# EAGLE design channel-link-test-board (EAGLE 9.6.2)
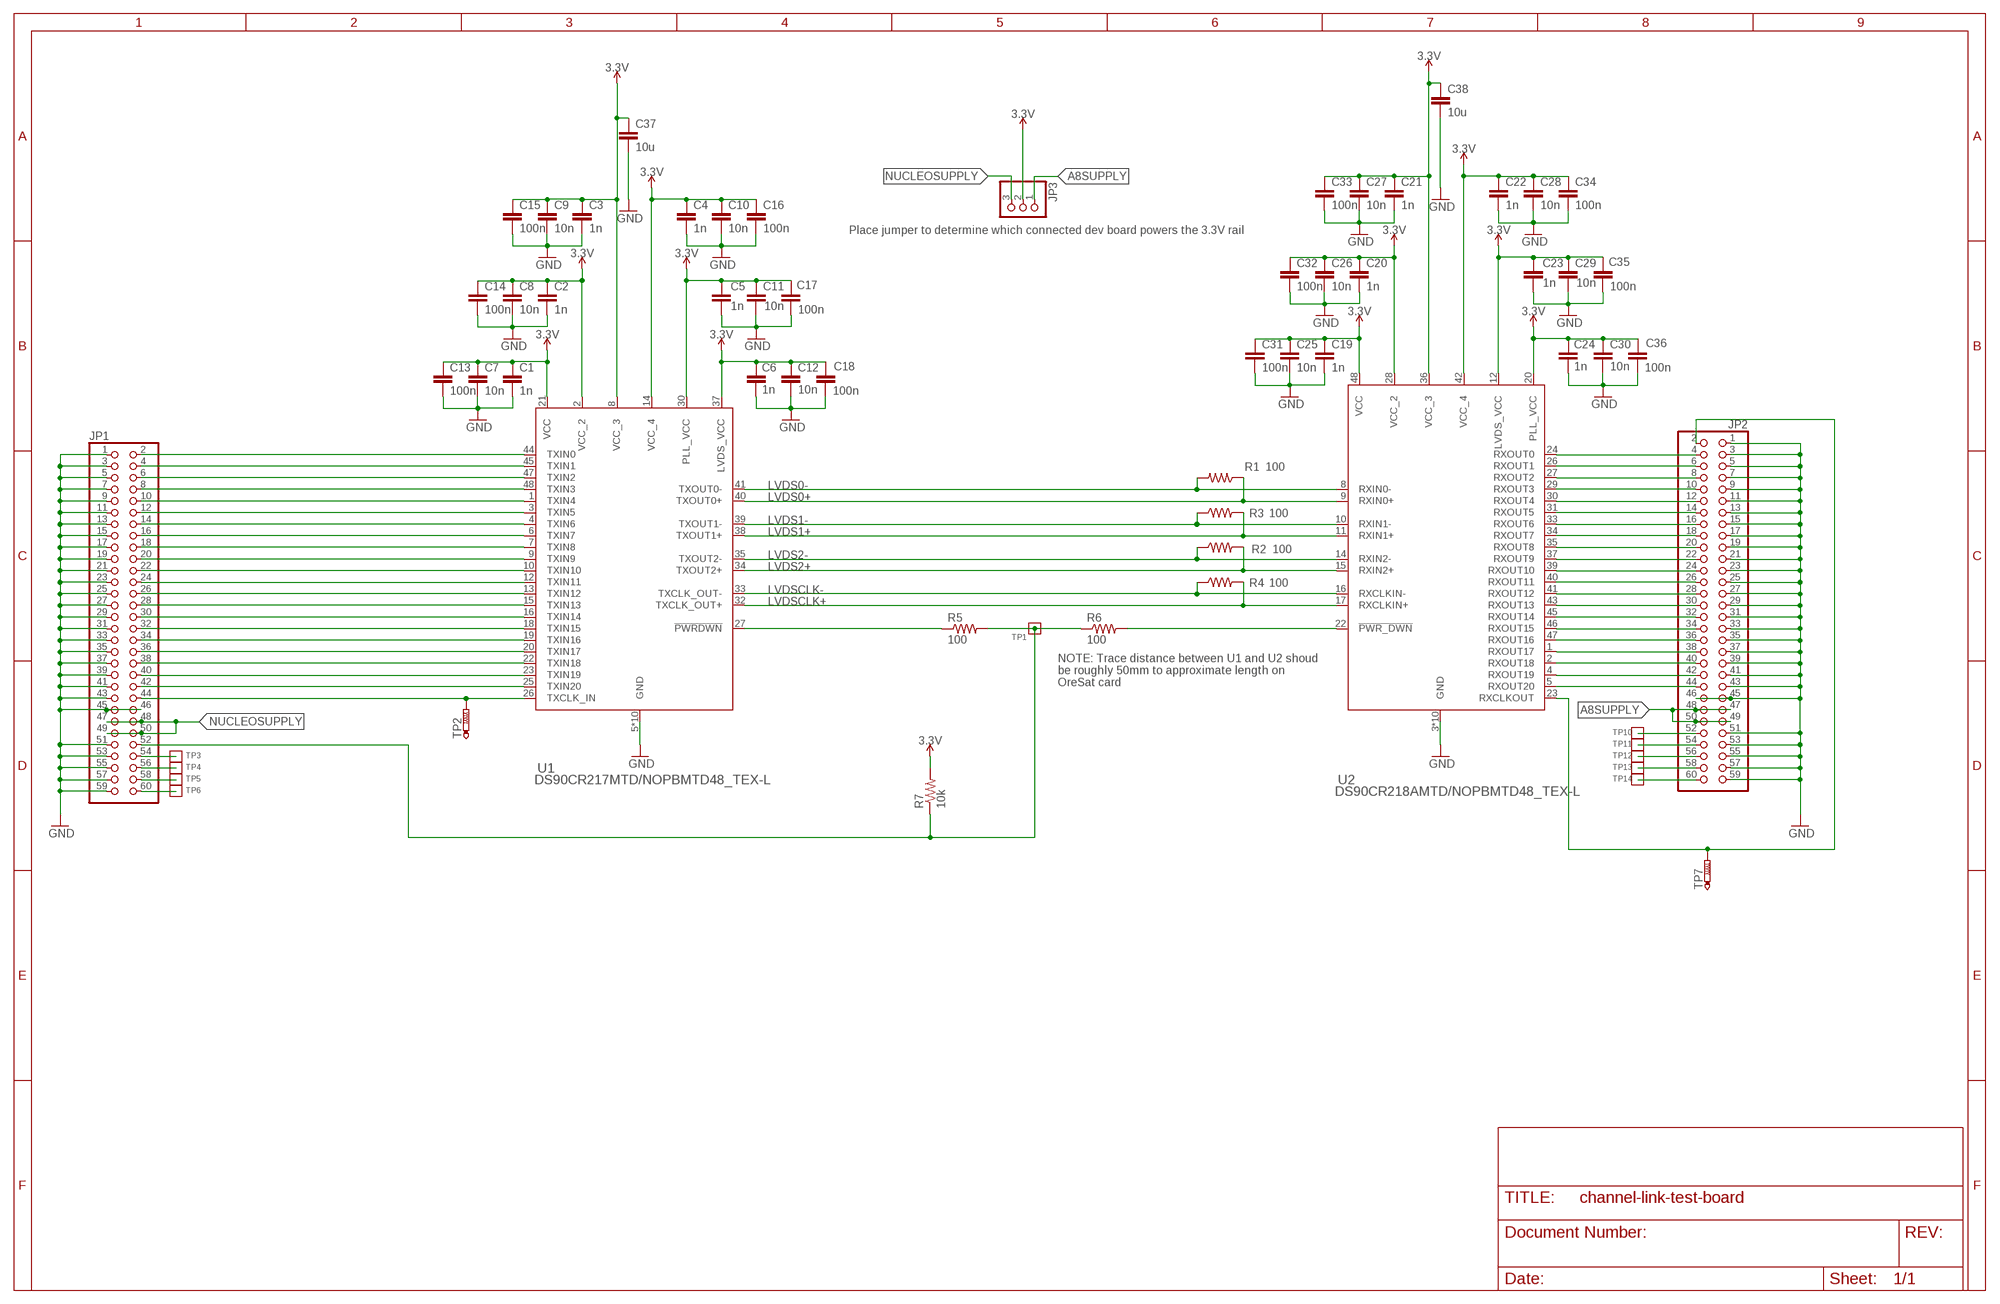
[diagram p0: schematic, sheet 1]

## Parts
C1  1n  C-EU0402-C-NOSILK  [.0402-C-NOSILK]
C2  1n  C-EU0402-C-NOSILK  [.0402-C-NOSILK]
C3  1n  C-EU0402-C-NOSILK  [.0402-C-NOSILK]
C4  1n  C-EU0402-C-NOSILK  [.0402-C-NOSILK]
C5  1n  C-EU0402-C-NOSILK  [.0402-C-NOSILK]
C6  1n  C-EU0402-C-NOSILK  [.0402-C-NOSILK]
C7  10n  C-EU0603-C-NOSILK  [.0603-C-NOSILK]
C8  10n  C-EU0603-C-NOSILK  [.0603-C-NOSILK]
C9  10n  C-EU0603-C-NOSILK  [.0603-C-NOSILK]
C10  10n  C-EU0603-C-NOSILK  [.0603-C-NOSILK]
C11  10n  C-EU0603-C-NOSILK  [.0603-C-NOSILK]
C12  10n  C-EU0402-C-NOSILK  [.0402-C-NOSILK]
C13  100n  C-EU0805-C-NOSILK  [.0805-C-NOSILK]
C14  100n  C-EU0402-C-NOSILK  [.0402-C-NOSILK]
C15  100n  C-EU0805-C-NOSILK  [.0805-C-NOSILK]
C16  100n  C-EU0805-C-NOSILK  [.0805-C-NOSILK]
C17  100n  C-EU0805-C-NOSILK  [.0805-C-NOSILK]
C18  100n  C-EU0805-C-NOSILK  [.0805-C-NOSILK]
C19  1n  C-EU0402-C-NOSILK  [.0402-C-NOSILK]
C20  1n  C-EU0402-C-NOSILK  [.0402-C-NOSILK]
C21  1n  C-EU0402-C-NOSILK  [.0402-C-NOSILK]
C22  1n  C-EU0402-C-NOSILK  [.0402-C-NOSILK]
C23  1n  C-EU0402-C-NOSILK  [.0402-C-NOSILK]
C24  1n  C-EU0402-C-NOSILK  [.0402-C-NOSILK]
C25  10n  C-EU0402-C-NOSILK  [.0402-C-NOSILK]
C26  10n  C-EU0603-C-NOSILK  [.0603-C-NOSILK]
C27  10n  C-EU0603-C-NOSILK  [.0603-C-NOSILK]
C28  10n  C-EU0603-C-NOSILK  [.0603-C-NOSILK]
C29  10n  C-EU0603-C-NOSILK  [.0603-C-NOSILK]
C30  10n  C-EU0603-C-NOSILK  [.0603-C-NOSILK]
C31  100n  C-EU0402-C-NOSILK  [.0402-C-NOSILK]
C32  100n  C-EU0805-C-NOSILK  [.0805-C-NOSILK]
C33  100n  C-EU0805-C-NOSILK  [.0805-C-NOSILK]
C34  100n  C-EU0805-C-NOSILK  [.0805-C-NOSILK]
C35  100n  C-EU0805-C-NOSILK  [.0805-C-NOSILK]
C36  100n  C-EU0805-C-NOSILK  [.0805-C-NOSILK]
C37  10u  C-EU0603-C-NOSILK  [.0603-C-NOSILK]
C38  10u  C-EU0603-C-NOSILK  [.0603-C-NOSILK]
JP1  PINHD-2X30  [2X30]
JP2  PINHD-2X30  [2X30]
JP3  PINHD-1X3  [1X03]
R1  100  R-US_0201-C-NOSILK  [.0201-C-NOSILK]
R2  100  R-US_0201-C-NOSILK  [.0201-C-NOSILK]
R3  100  R-US_0201-C-NOSILK  [.0201-C-NOSILK]
R4  100  R-US_0201-C-NOSILK  [.0201-C-NOSILK]
R5  100  R-US_0603-C-NOSILK  [.0603-C-NOSILK]
R6  100  R-US_0603-C-NOSILK  [.0603-C-NOSILK]
R7  10k  R-US_0603-C-NOSILK  [.0603-C-NOSILK]
TP1  TEST-POINT-LARGE-SQUARE  [1X01]
TP2  PTR1B2,54  [B2,54]
TP3  TEST-POINT-LARGE-SQUARE  [1X01]
TP4  TEST-POINT-LARGE-SQUARE  [1X01]
TP5  TEST-POINT-LARGE-SQUARE  [1X01]
TP6  TEST-POINT-LARGE-SQUARE  [1X01]
TP7  PTR1B2,54  [B2,54]
TP10  TEST-POINT-LARGE-SQUARE  [1X01]
TP11  TEST-POINT-LARGE-SQUARE  [1X01]
TP12  TEST-POINT-LARGE-SQUARE  [1X01]
TP13  TEST-POINT-LARGE-SQUARE  [1X01]
TP14  TEST-POINT-LARGE-SQUARE  [1X01]
U1  DS90CR217MTD/NOPBMTD48_TEX-L  [MTD48_TEX-L]
U2  DS90CR218AMTD/NOPBMTD48_TEX-L  [MTD48_TEX-L]

## Nets
3.3V: C1.1 C2.1 C3.1 C4.1 C5.1 C6.1 C7.1 C8.1 C9.1 C10.1 C11.1 C12.1 C13.1 C14.1 C15.1 C16.1 C17.1 C18.1 C19.1 C20.1 C21.1 C22.1 C23.1 C24.1 C25.1 C26.1 C27.1 C28.1 C29.1 C30.1 C31.1 C32.1 C33.1 C34.1 C35.1 C36.1 C37.1 C38.1 JP3.2 R7.2 U1.2(VCC_2) U1.8(VCC_3) U1.14(VCC_4) U1.21(VCC) U1.30(PLL_VCC) U1.37(LVDS_VCC) U2.12(LVDS_VCC) U2.20(PLL_VCC) U2.28(VCC_2) U2.36(VCC_3) U2.42(VCC_4) U2.48(VCC)
A8SUPPLY: JP2.47 JP2.48 JP2.49 JP2.50 JP3.1
GND: C1.2 C2.2 C3.2 C4.2 C5.2 C6.2 C7.2 C8.2 C9.2 C10.2 C11.2 C12.2 C13.2 C14.2 C15.2 C16.2 C17.2 C18.2 C19.2 C20.2 C21.2 C22.2 C23.2 C24.2 C25.2 C26.2 C27.2 C28.2 C29.2 C30.2 C31.2 C32.2 C33.2 C34.2 C35.2 C36.2 C37.2 C38.2 JP1.1 JP1.3 JP1.5 JP1.7 JP1.9 JP1.11 JP1.13 JP1.15 JP1.17 JP1.19 JP1.21 JP1.23 JP1.25 JP1.27 JP1.29 JP1.31 JP1.33 JP1.35 JP1.37 JP1.39 JP1.41 JP1.43 JP1.45 JP1.46 JP1.51 JP1.53 JP1.55 JP1.57 JP1.59 JP2.1 JP2.3 JP2.5 JP2.7 JP2.9 JP2.11 JP2.13 JP2.15 JP2.17 JP2.19 JP2.21 JP2.23 JP2.25 JP2.27 JP2.29 JP2.31 JP2.33 JP2.35 JP2.37 JP2.39 JP2.41 JP2.43 JP2.45 JP2.46 JP2.51 JP2.53 JP2.55 JP2.57 JP2.59 U1.5(GND) U1.11(GND) U1.17(GND) U1.24(GND) U1.28(GND) U1.29(GND) U1.31(GND) U1.36(GND) U1.42(GND) U1.46(GND) U2.3(GND) U2.7(GND) U2.13(GND) U2.18(GND) U2.19(GND) U2.21(GND) U2.25(GND) U2.32(GND) U2.38(GND) U2.44(GND)
LVDS0+: R1.1 U1.40(TXOUT0+) U2.9(RXIN0+)
LVDS0-: R1.2 U1.41(TXOUT0-) U2.8(RXIN0-)
LVDS1+: R3.2 U1.38(TXOUT1+) U2.11(RXIN1+)
LVDS1-: R3.1 U1.39(TXOUT1-) U2.10(RXIN1-)
LVDS2+: R2.2 U1.34(TXOUT2+) U2.15(RXIN2+)
LVDS2-: R2.1 U1.35(TXOUT2-) U2.14(RXIN2-)
LVDSCLK+: R4.2 U1.32(TXCLK_OUT+) U2.17(RXCLKIN+)
LVDSCLK-: R4.1 U1.33(TXCLK_OUT-) U2.16(RXCLKIN-)
N$9: JP1.2 U1.44(TXIN0)
N$10: JP1.4 U1.45(TXIN1)
N$11: JP1.6 U1.47(TXIN2)
N$12: JP1.8 U1.48(TXIN3)
N$13: JP1.10 U1.1(TXIN4)
N$14: JP1.12 U1.3(TXIN5)
N$15: JP1.14 U1.4(TXIN6)
N$16: JP1.16 U1.6(TXIN7)
N$17: JP1.18 U1.7(TXIN8)
N$18: JP1.20 U1.9(TXIN9)
N$19: JP1.22 U1.10(TXIN10)
N$20: JP1.24 U1.12(TXIN11)
N$21: JP1.26 U1.13(TXIN12)
N$22: JP1.28 U1.15(TXIN13)
N$23: JP1.30 U1.16(TXIN14)
N$24: JP1.32 U1.18(TXIN15)
N$25: JP1.34 U1.19(TXIN16)
N$26: JP1.36 U1.20(TXIN17)
N$27: JP1.38 U1.22(TXIN18)
N$28: JP1.40 U1.23(TXIN19)
N$29: JP1.42 U1.25(TXIN20)
N$30: JP1.44 TP2.TP U1.26(TXCLK_IN)
N$31: JP2.4 U2.24(RXOUT0)
N$32: JP2.6 U2.26(RXOUT1)
N$33: R5.1 U1.27(!PWRDWN)
N$34: R6.2 U2.22(!PWR_DWN)
N$35: JP2.8 U2.27(RXOUT2)
N$36: JP2.10 U2.29(RXOUT3)
N$37: JP2.12 U2.30(RXOUT4)
N$38: JP2.14 U2.31(RXOUT5)
N$39: JP2.16 U2.33(RXOUT6)
N$40: JP2.18 U2.34(RXOUT7)
N$41: JP2.20 U2.35(RXOUT8)
N$42: JP2.22 U2.37(RXOUT9)
N$43: JP2.24 U2.39(RXOUT10)
N$44: JP2.26 U2.40(RXOUT11)
N$45: JP2.28 U2.41(RXOUT12)
N$48: JP2.52 TP10.1
N$49: JP2.54 TP11.1
N$50: JP2.56 TP12.1
N$51: JP2.58 TP13.1
N$52: JP2.60 TP14.1
N$53: JP2.30 U2.43(RXOUT13)
N$54: JP2.32 U2.45(RXOUT14)
N$55: JP2.34 U2.46(RXOUT15)
N$56: JP2.36 U2.47(RXOUT16)
N$57: JP1.52 R5.2 R6.1 R7.1 TP1.1
N$58: JP1.54 TP3.1
N$59: JP1.56 TP4.1
N$60: JP1.58 TP5.1
N$61: JP1.60 TP6.1
N$62: JP2.38 U2.1(RXOUT17)
N$63: JP2.40 U2.2(RXOUT18)
N$64: JP2.42 U2.4(RXOUT19)
N$65: JP2.44 U2.5(RXOUT20)
N$66: JP2.2 TP7.TP U2.23(RXCLKOUT)
NUCLEOSUPPLY: JP1.47 JP1.48 JP1.49 JP1.50 JP3.3

## Notes on the sheet
- Place jumper to determine which connected dev board powers the 3.3V rail
- NOTE: Trace distance between U1 and U2 shoud 
  be roughly 50mm to approximate length on 
  OreSat card

## Library data of the parts
C1-C6 C19-C24 = oresat-rcl:C-EU: CAPACITOR, European symbol; DIS: Digi-Key; DPN: 490-6350-1-ND; MFR: Murata; MPN: GRM155R71H102KA01J
C7-C12 C25-C30 = oresat-rcl:C-EU: CAPACITOR, European symbol; DIS: Digi-Key; DPN: 399-7842-1-ND; MFR: Kemet; MPN: C0603C103M5RACTU
C13-C18 C31-C36 = oresat-rcl:C-EU: CAPACITOR, European symbol; DIS: Digi-Key; DPN: 399-1177-1-ND; MFR: Kemet; MPN: C0805C104Z5VACTU
C37 C38 = oresat-rcl:C-EU: CAPACITOR, European symbol; DIS: Digi-Key; DPN: 490-14372-1-ND; MFR: Murata; MPN: GRM188R61A106KE69J
JP1 JP2 = pinhead:PINHD-2X30: PIN HEADER; DIS: Digi-Key; DPN: 609-3528-ND; MFR: Amphenol; MPN: 71918-160LF
JP3 = pinhead:PINHD-1X3: PIN HEADER; DIS: Digi-Key; DPN: 732-5316-ND; MFR: Wurth; MPN: 61300311121
R1-R4 = oresat-rcl:R-US_: RESISTOR, American symbol; DIS: Dgi-Key; DPN: 311-100MCT-ND; MFR: Yageo; MPN: RC0201FR-07100RL
R5 R6 = oresat-rcl:R-US_: RESISTOR, American symbol; DIS: Digi-Key; DPN: 311-100HRCT-ND; MFR: Yageo; MPN: RC0603FR-07100RL
R7 = oresat-rcl:R-US_: RESISTOR, American symbol; DIS: Digi-Key; DPN: 311-10.0KHRCT-ND; MFR: Yageo; MPN: RC0603FR-0710KL
TP1 TP3-TP6 TP10-TP14 = oresat-misc:TEST-POINT-LARGE-SQUARE
TP2 TP7 = testpad:PTR1: TEST PIN
U1 = U-TI-DS90CR217-LVDSTransmitter:DS90CR217MTD/NOPB; DIS: Digi-Key; DPN: DS90CR218AMTD/NOPB-ND; MFR: Texas Instruments; MPN: DS90CR218AMTD/NOPB
U2 = U-TI-DS90CR218-LVDSReceiver:DS90CR218AMTD/NOPB; DIS: Digi-Key; DPN: DS90CR218AMTD/NOPB-ND; MFR: Texas Instruments; MPN: DS90CR218AMTD/NOPB

## Board
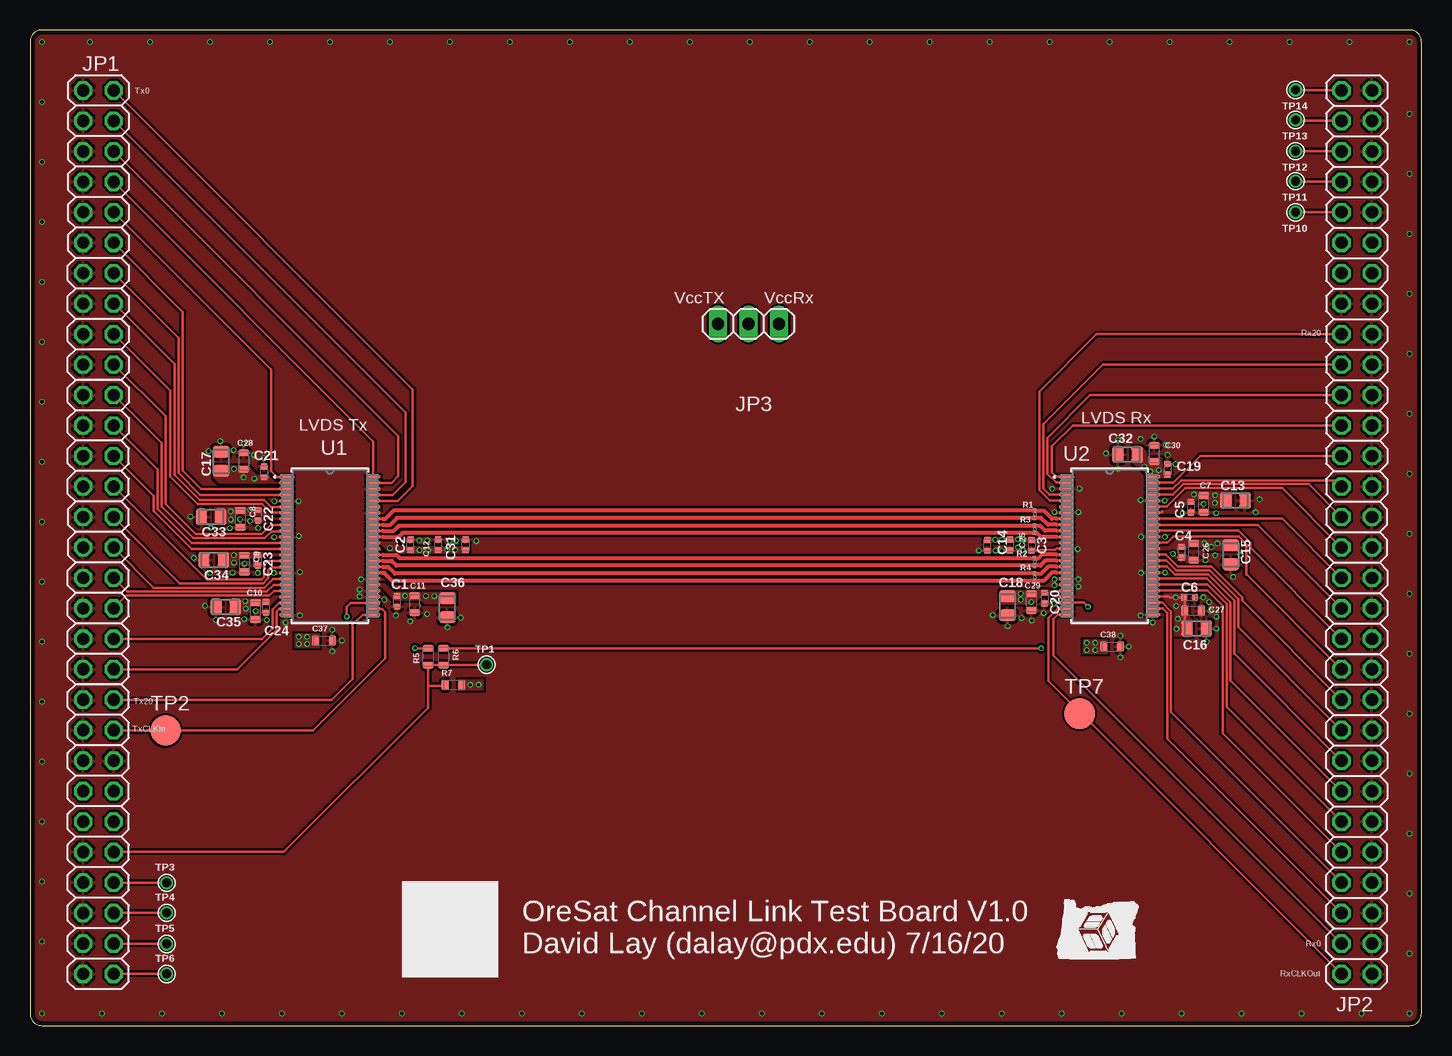
[diagram p1: board, top side]
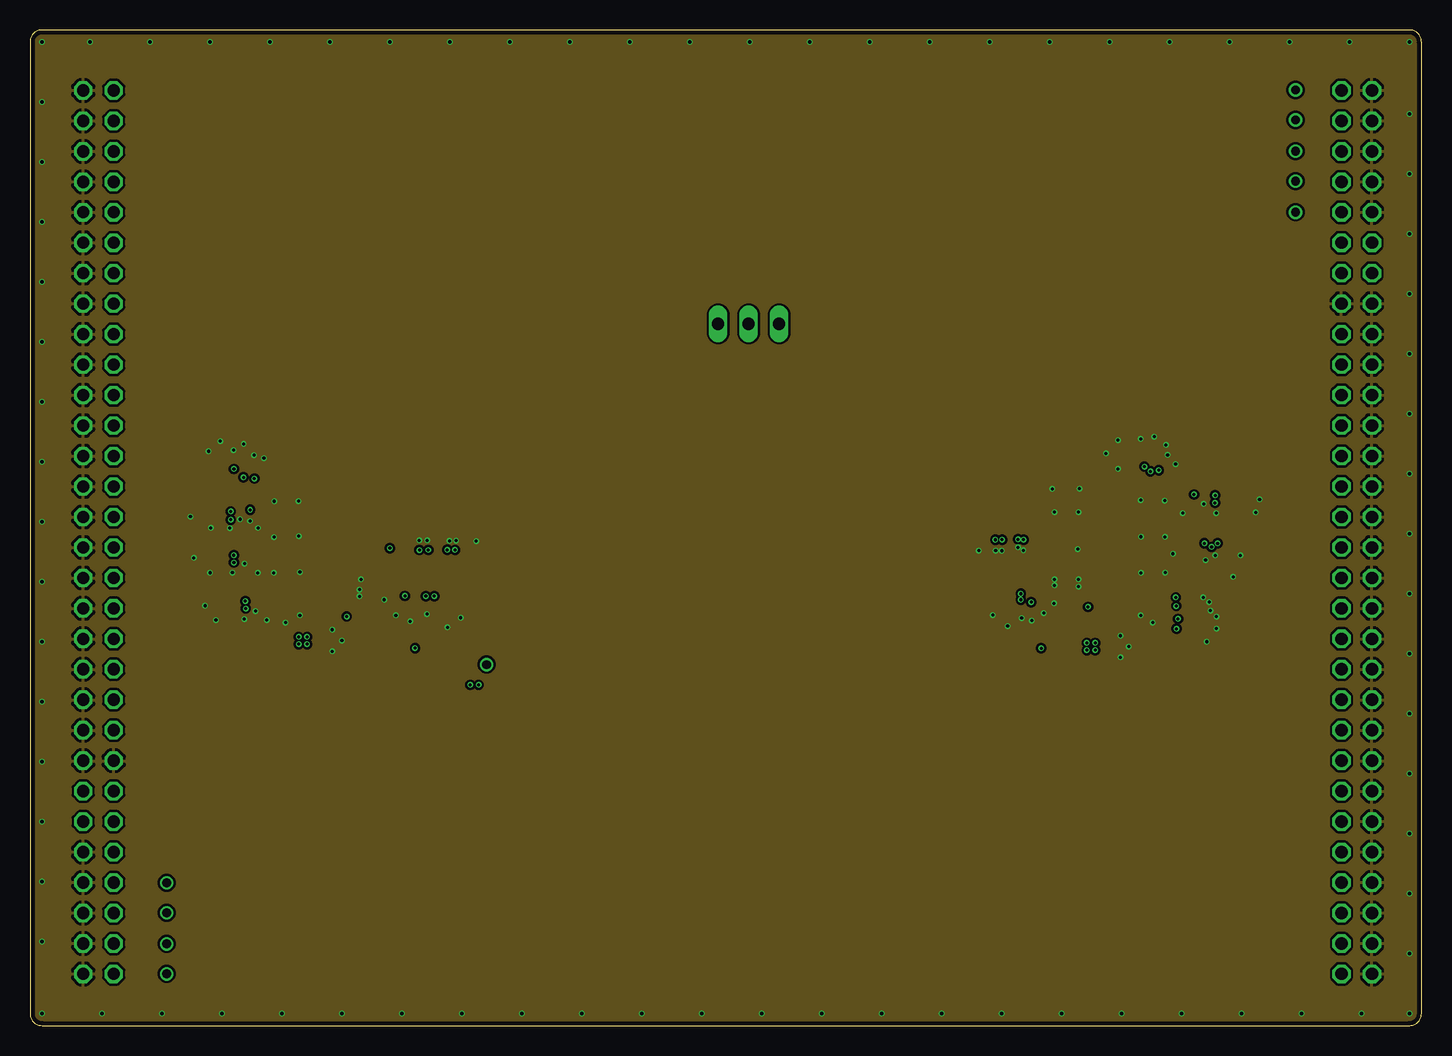
[diagram p2: board, inner layer Route2]
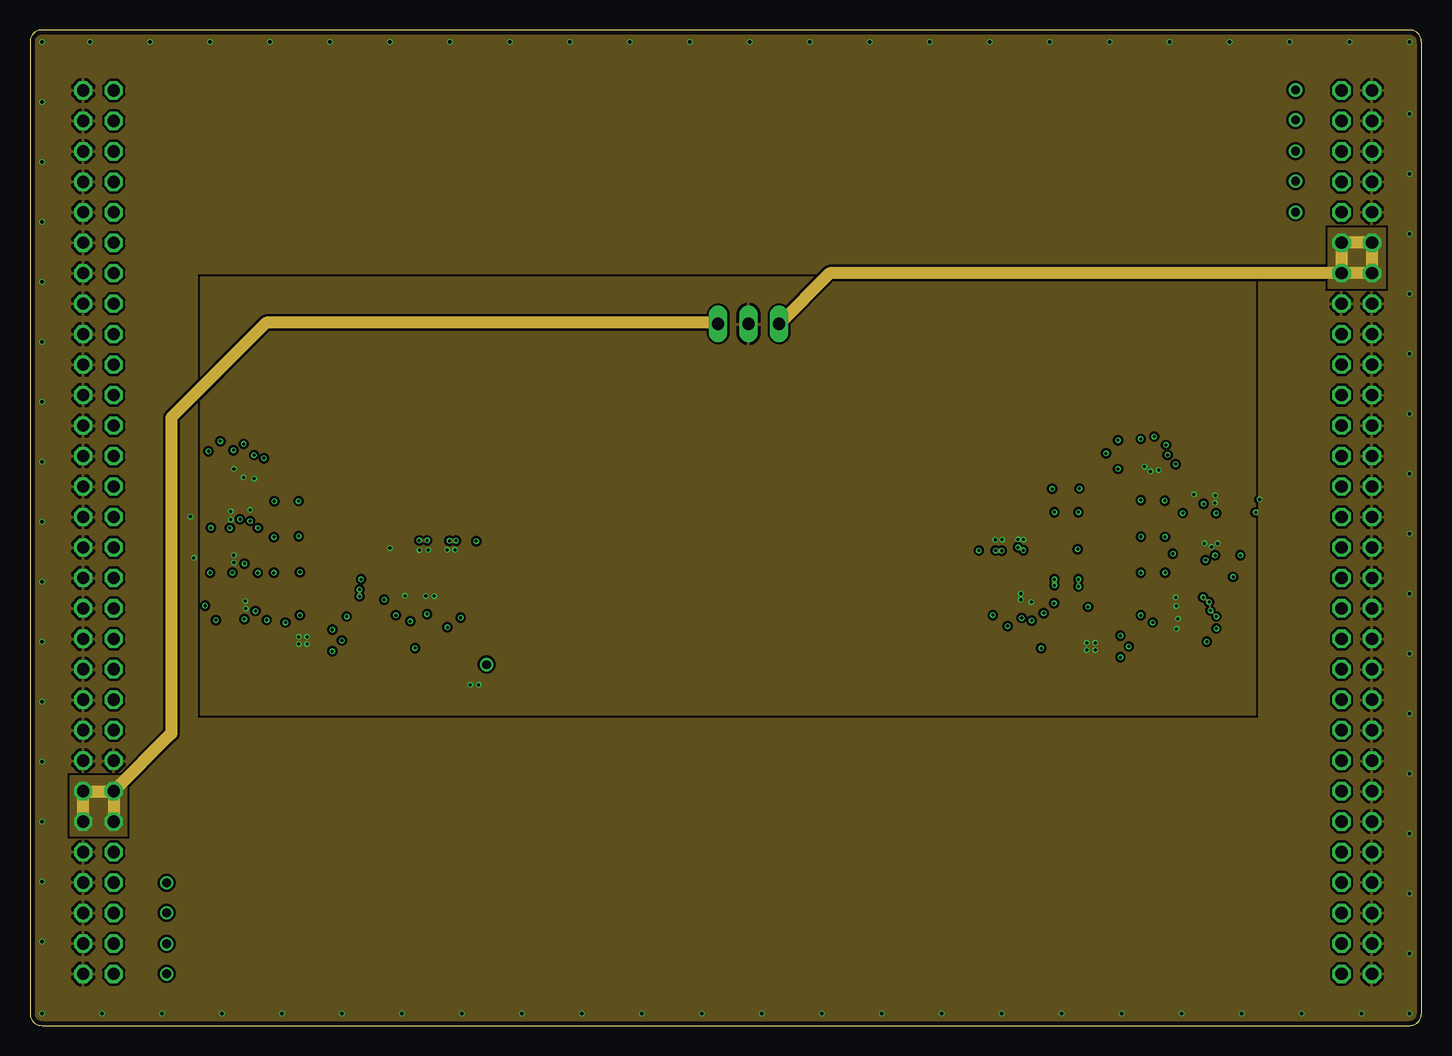
[diagram p3: board, inner layer Route15]
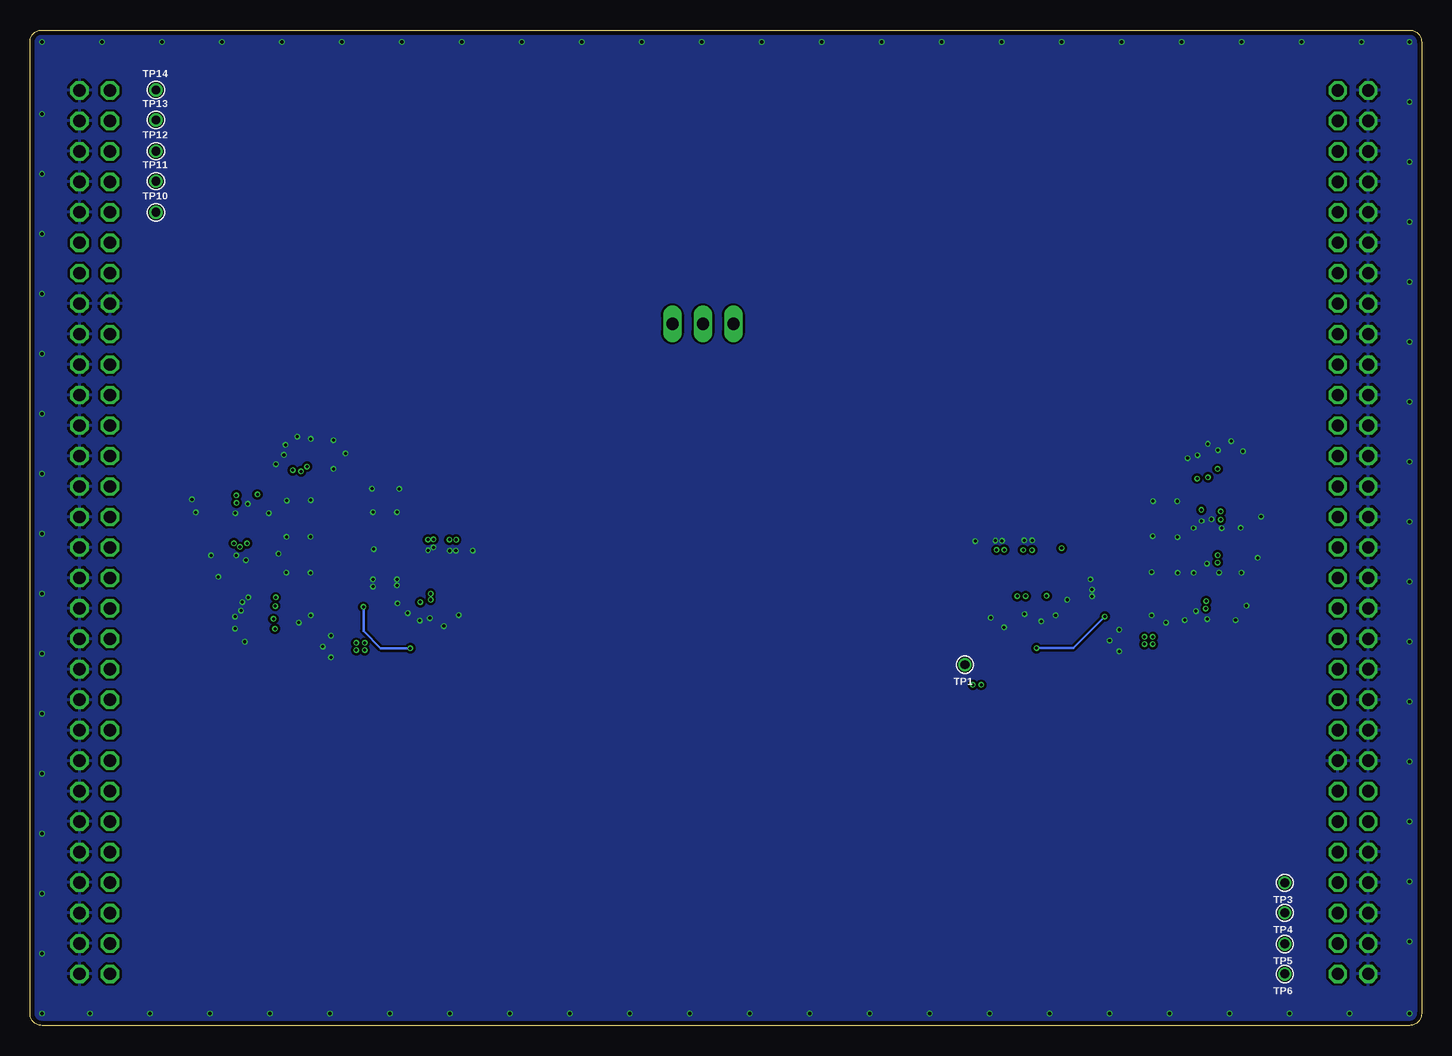
[diagram p4: board, bottom side, seen from below]

Size 116 x 83 mm. Coordinates in mm from the lower left corner, seen from the top.
Outline: 0,82 0,1 arc90 1,0 115,0 arc90 116,1 116,82 arc90 115,83 1,83 arc90 0,82
Copper layers (1*2*15*16): Top 0.035559375mm / dielectric 0.17018125mm / Route2 0.01778125mm / dielectric 47mil / Route15 0.01778125mm / dielectric 0.17018125mm / Bottom 0.035559375mm
Design rules "oshpark-4layer-tented": minimum track width 5mil, minimum drill 10mil, track to track 5mil, track to pad 5mil, pad to pad 5mil, via to via 5mil, smd to smd 5mil, copper to edge 15mil, drill to drill 6mil, minimum pad ring 4mil, minimum via ring 4mil, stop-mask expansion 2.5mil, vias tented up to drill 20mil, thermal gap 10mil

### Footprints (pad centres in the part's own frame; a part is rotated, then mirrored left to right if it is on the bottom)
.0402-C-NOSILK = smd 0.5 x 0.6: 1 -0.45,0; 2 0.45,0
.0603-C-NOSILK = smd 0.6 x 0.9: 1 -0.7,0; 2 0.7,0
.0805-C-NOSILK = smd 0.95 x 1.35: 1 -0.8,0; 2 0.8,0
2X30 = drill 1.016 octagon: 1 -38.1,-1.27; 2 -38.1,1.27; 3 -35.56,-1.27; 4 -35.56,1.27; 5 -33.02,-1.27; 6 -33.02,1.27; 7 -30.48,-1.27; 8 -30.48,1.27; 9 -27.94,-1.27; 10 -27.94,1.27; 11 -25.4,-1.27; 12 -25.4,1.27; 13 -22.86,-1.27; 14 -22.86,1.27; 15 -20.32,-1.27; 16 -20.32,1.27; 17 -17.78,-1.27; 18 -17.78,1.27; 19 -15.24,-1.27; 20 -15.24,1.27; 21 -12.7,-1.27; 22 -12.7,1.27; 23 -10.16,-1.27; 24 -10.16,1.27; 25 -7.62,-1.27; 26 -7.62,1.27; 27 -5.08,-1.27; 28 -5.08,1.27; 29 -2.54,-1.27; 30 -2.54,1.27; 31 0,-1.27; 32 0,1.27; 33 2.54,-1.27; 34 2.54,1.27; 35 5.08,-1.27; 36 5.08,1.27; 37 7.62,-1.27; 38 7.62,1.27; 39 10.16,-1.27; 40 10.16,1.27; 41 12.7,-1.27; 42 12.7,1.27; 43 15.24,-1.27; 44 15.24,1.27; 45 17.78,-1.27; 46 17.78,1.27; 47 20.32,-1.27; 48 20.32,1.27; 49 22.86,-1.27; 50 22.86,1.27; 51 25.4,-1.27; 52 25.4,1.27; 53 27.94,-1.27; 54 27.94,1.27; 55 30.48,-1.27; 56 30.48,1.27; 57 33.02,-1.27; 58 33.02,1.27; 59 35.56,-1.27; 60 35.56,1.27
1X03 = drill 1.016 long: 1 -2.54,0; 2 0,0; 3 2.54,0
.0201-C-NOSILK = smd 0.35 x 0.3: 1 -0.3,0; 2 0.3,0
1X01 = drill 0.737 pad 1.1: 1 0,0
B2,54 = smd 2.54 x 2.54: TP 0,0
MTD48_TEX-L = smd 1.162 x 0.199: 1 -3.62,5.75; 2 -3.62,5.25; 3 -3.62,4.75; 4 -3.62,4.25; 5 -3.62,3.75; 6 -3.62,3.25; 7 -3.62,2.75; 8 -3.62,2.25; 9 -3.62,1.75; 10 -3.62,1.25; 11 -3.62,0.75; 12 -3.62,0.25; 13 -3.62,-0.25; 14 -3.62,-0.75; 15 -3.62,-1.25; 16 -3.62,-1.75; 17 -3.62,-2.25; 18 -3.62,-2.75; 19 -3.62,-3.25; 20 -3.62,-3.75; 21 -3.62,-4.25; 22 -3.62,-4.75; 23 -3.62,-5.25; 24 -3.62,-5.75; 25 3.62,-5.75; 26 3.62,-5.25; 27 3.62,-4.75; 28 3.62,-4.25; 29 3.62,-3.75; 30 3.62,-3.25; 31 3.62,-2.75; 32 3.62,-2.25; 33 3.62,-1.75; 34 3.62,-1.25; 35 3.62,-0.75; 36 3.62,-0.25; 37 3.62,0.25; 38 3.62,0.75; 39 3.62,1.25; 40 3.62,1.75; 41 3.62,2.25; 42 3.62,2.75; 43 3.62,3.25; 44 3.62,3.75; 45 3.62,4.25; 46 3.62,4.75; 47 3.62,5.25; 48 3.62,5.75
MTD48_TEX-L' = smd 1.168 x 0.178: 1 -3.619,5.75; 2 -3.619,5.25; 3 -3.619,4.75; 4 -3.619,4.25; 5 -3.619,3.75; 6 -3.619,3.25; 7 -3.619,2.75; 8 -3.619,2.25; 9 -3.619,1.75; 10 -3.619,1.25; 11 -3.619,0.75; 12 -3.619,0.25; 13 -3.619,-0.25; 14 -3.619,-0.75; 15 -3.619,-1.25; 16 -3.619,-1.75; 17 -3.619,-2.25; 18 -3.619,-2.75; 19 -3.619,-3.25; 20 -3.619,-3.75; 21 -3.619,-4.25; 22 -3.619,-4.75; 23 -3.619,-5.25; 24 -3.619,-5.75; 25 3.619,-5.75; 26 3.619,-5.25; 27 3.619,-4.75; 28 3.619,-4.25; 29 3.619,-3.75; 30 3.619,-3.25; 31 3.619,-2.75; 32 3.619,-2.25; 33 3.619,-1.75; 34 3.619,-1.25; 35 3.619,-0.75; 36 3.619,-0.25; 37 3.619,0.25; 38 3.619,0.75; 39 3.619,1.25; 40 3.619,1.75; 41 3.619,2.25; 42 3.619,2.75; 43 3.619,3.25; 44 3.619,3.75; 45 3.619,4.25; 46 3.619,4.75; 47 3.619,5.25; 48 3.619,5.75

### Placement (x,y rotation side)
C1  30.6,35.37 270 top
C2  31.71,40.07 90 top
C3  83.49,40.03 270 top
C4  95.99,39.47 270 top
C5  96.79,43.21 270 top
C6  96.65,35.69 0 top
C7  97.85,43.49 270 top
C8  17.55,42.25 270 top
C9  17.87,38.51 270 top
C10  18.8,34.55 270 top
C11  32.07,35.13 270 top
C12  34.03,40.07 90 top
C13  100.49,43.77 0 top
C14  79.8,40.04 270 top
C15  100.09,39.24 270 top
C16  97.25,33.09 0 top
C17  15.94,47.04 90 top
C18  81.49,35 270 top
C19  94.82,46.38 90 top
C20  84.58,35.63 270 top
C21  19.52,46.16 90 top
C22  19.01,42.54 270 top
C23  18.98,38.79 270 top
C24  19.68,34.87 270 top
C25  81.71,40.06 270 top
C26  97.01,39.5 270 top
C27  96.95,34.58 0 top
C28  17.82,47.06 90 top
C29  83.48,35.3 270 top
C30  93.72,47.69 90 top
C31  36.31,40.07 90 top
C32  91.49,47.61 180 top
C33  15.1,42.41 180 top
C34  15.31,38.81 180 top
C35  16.32,34.91 180 top
C36  34.79,34.83 270 top
C37  24.5,32.1 0 top
C38  90.2,31.6 0 top
JP1  5.7,39.86 270 top
JP2  110.6,42.4 90 top
JP3  59.9,58.5 180 top
R1  83.73,42.63 90 top
R2  83.73,38.66 270 top
R3  83.73,41.38 270 top
R4  83.73,37.38 270 top
R5  33.19,30.75 270 top
R6  34.48,30.75 90 top
R7  35.3,28.4 0 top
TP1  38.06,30.09 0 top
TP2  11.3,24.6 0 top
TP3  11.4,11.9 0 top
TP4  11.4,9.4 0 top
TP5  11.4,6.8 0 top
TP6  11.4,4.3 0 top
TP7  87.5,26 0 top
TP10  105.5,67.8 180 top
TP11  105.5,70.4 180 top
TP12  105.5,72.9 180 top
TP13  105.5,75.5 180 top
TP14  105.5,78 180 top
U1  25,40 0 top
U2  DS90CR218AMTD/NOPBMTD48_TEX-L  [MTD48_TEX-L']  90,40 0 top

### Tracks (layer width: path | path; a pad name or v marks a point on that pad's centre or on a via)
3.3V  (via drill 0.25)
  Top 0.2: U2.28 94.94,35.75 95,35.69 C6.1 96.25,35.64 C27.1 96.25,33.29 C16.1 | U2.42 94.35,42.75 94.4,42.8
  other vias: 95.58,33.08 95.56,34.97 95.52,35.69 95.7,33.9 97.9,40.2 92.9,46.6 83.47,35.3 82.6,36 82.6,35.5 17.8,45.7 18.7,45.6 17,46.4 18.35,42.99 16.74,42.86 16.74,42.17 17.95,35.38 17.98,34.77 88.8,31.9 88.8,31.3 23.1,32.4 23.1,31.8 94.1,46.3 93.4,46.2 98.78,43.57 97.04,44.27 98.8,44.2 99,40.2 98.5,39.9 88.1,31.9 88.1,31.3 22.4,32.4 22.4,31.8 33.7,35.8 31.26,35.82 33,35.8 36.7,28.4 37.4,28.4 16.99,39.21 17,38.6 35.43,39.65 34.78,39.66 33.2,39.65 32.47,39.64 30,39.8 81.03,40.51 80.47,40.5 82.37,40.53 82.83,40.51
  pour Route15 (isolate 0.2): 14.2,62.4 14.2,25.9 102.2,25.9 102.2,62.4
  pour Top (no thermals): 96.9,32.5 96.9,33.8 96.6,34.1 96.6,35.1 96.5,35.2 96.5,36 94.5,36 94.5,35.5 95.3,34.7 95.3,32.5
  pour Top (no thermals): 93,39.7 96.3,39.7 96.5,39.9 97.9,39.9 98.2,39.6 100.5,39.6 100.5,40.5 95.5,40.5 94.9,39.9 93,39.9
  pour Top (no thermals): 96.4,44.6 100.2,44.6 100.2,43.1 98.6,43.1 98.3,43.4 98.3,43.6 98,43.9 97.3,43.9 96.8,43.4 96.2,43.4 95.5,42.7 94.3,42.7 94.3,43 94.8,43
  pour Top (no thermals): 93.1,45.7 95.1,45.7 95.1,46.1 95,46.2 94.5,46.2 94.4,46.3 94.4,47.2 94.3,47.3 93.3,47.3 93.1,47.5 93.1,47.8 92.7,48.2 91.9,48.2 91.9,47 92.2,46.7 92.4,46.7 93.1,46
  pour Top (no thermals): 86.9,36.2 85.4,36.2 85.1,35.9 84.4,35.9 83.6,35.1 80.9,35.1 80.9,36.2 81,36.3 86.9,36.3
  pour Top (no thermals): 21.9,42.2 19.8,42.2 19.5,42.5 17,42.5 17,41.8 15.4,41.8 15.4,43.31 19.29,43.31 20.3,42.3 21.9,42.3
  pour Top (no thermals): 15.3,46.7 18.1,46.7 18.9,45.9 19.8,45.9 20.4,45.3 21.9,45.3 21.9,45.2 15.8,45.2 15.3,45.7
  pour Top (no thermals): 16.1,39.45 16.1,38.2 17.1,38.2 17.3,38.4 17.3,38.8 17.5,39 19.3,39 19.5,39.2 21.9,39.2 21.9,39.3 19.6,39.3 19.35,39.55
  pour Top (no thermals): 21.9,35.8 20.3,35.8 20.1,35.6 16.6,35.6 16.6,34.25 18.05,34.25 18.4,34.6 18.4,35 19.4,35 19.5,35.1 20.1,35.1 20.7,35.7 21.9,35.7
  pour Top (no thermals): 28.2,36.8 28.2,36.7 29.2,36.7 30.4,35.5 32.6,35.5 32.9,35.2 35.5,35.2 35.5,36.1 30.3,36.1 29.6,36.8
  pour Top (no thermals): 87.8,32.2 89.8,32.2 89.8,31 87.8,31
  pour Top (no thermals): 22.1,32.7 24.1,32.7 24.1,31.5 22.1,31.5
  pour Top (no thermals): 35.7,28.8 35.7,28 37.8,28 37.8,28.8
  pour Top (no thermals): 28.1,40.3 28.1,40.2 29.2,40.2 30,39.4 36.6,39.4 36.6,39.9 30.9,39.9 30.5,40.3
  pour Top (isolate 0.2, no thermals): 86.9,40.3 84.2,40.3 83.8,40.7 79.5,40.7 79.5,40.3 83.7,40.3 83.9,40.1 83.9,39.8 85.2,39.8 85.5,40.1 85.7,40.1 85.8,40.2 86.9,40.2
A8SUPPLY
  Route15 1: JP2.48 JP2.50 JP2.49 JP2.47 JP2.48 | JP2.48 66.66,62.72 JP3.1
  pour Route15 (isolate 0.2, no thermals): 108.2,66.5 108.2,61.5 113,61.5 113,66.5
GND  (via drill 0.25)
  Top 0.152: U2.13 85.55,39.75 85.43,39.63 84.2,39.63 84.15,39.59 C3.2
  other vias: 97.8,35.7 98.4,34.6 98.9,33.1 98.9,34.1 98.3,35.3 98.1,32 87.34,39.72 94.63,37.76 98,38.8 95.27,39.33 94.62,40.73 100.9,39.2 100.3,37.4 97.84,43.5 96.1,42.73 98.88,42.72 102.17,42.78 102.5,43.86 94.83,47.57 95.5,46.8 93.72,49.1 90.7,48.8 94.7,48.4 89.7,47.7 92.6,48.9 90.7,46.4 85.22,44.75 87.48,44.76 82.66,33.98 80.27,34.22 85.37,35.2 84.51,34.39 83.51,33.76 18.69,47.56 14.88,47.88 15.87,48.71 16.97,47.96 19.5,47.3 17.81,48.48 22.39,43.72 20.36,43.71 17.51,42.21 18.35,42.06 19,41.48 13.37,42.43 15.08,41.5 16.66,41.47 20.34,40.71 17.88,38.5 18.98,37.74 16.88,37.75 13.65,38.99 15.01,37.75 20.33,37.74 18.8,34.56 19.73,33.81 17.87,33.88 14.6,35 15.5,33.8 22.5,34.2 21.3,33.6 27.47,36.35 27.47,35.77 29.52,35.5 34.8,33.2 31.7,33.7 30.5,34.2 33.1,34.3 35.9,34 27.6,37.2 25.2,33 26,32.1 25.2,31.2 91.6,31.6 90.9,32.5 90.9,30.7 93.6,33.6 92.6,34.2 87.4,37.2 87.4,36.6 85.4,37.2 85.4,36.7 87.4,42.8 85.4,42.8 98.8,39.2 81.5,33.3 94.6,43.75 92.6,43.8 92.61,40.75 92.61,37.74 22.5,37.8 22.4,40.8 1,1 6,1 11,1 16,1 21,1 26,1 31,1 36,1 41,1 46,1 51,1 56,1 61,1 66,1 71,1 76,1 81,1 86,1 91,1 96,1 101,1 106,1 111,1 115,1 115,6 115,11 115,16 115,21 115,26 115,31 115,36 115,41 115,46 115,51 115,56 115,61 115,66 115,71 115,76 115,82 110,82 105,82 100,82 95,82 90,82 85,82 80,82 75,82 70,82 65,82 60,82 55,82 50,82 45,82 40,82 35,82 30,82 25,82 20,82 15,82 10,82 5,82 1,82 1,77 1,72 1,67 1,62 1,57 1,52 1,47 1,42 1,37 1,32 1,27 1,22 1,17 1,12 1,7 32.45,40.44 34.96,40.41 37.2,40.38 33.11,40.44 35.52,40.42 79.1,39.6 80.5,39.6 81.01,39.58 82.36,39.87 82.81,39.61
  pour Route2 (isolate 0.2): 0,82 0,1 arc90 1,0 115,0 arc90 116,1 116,82 arc90 115,83 1,83 arc90
  pour Bottom (isolate 0.2, rank 6): 0,82 0,1 arc90 1,0 115,0 arc90 116,1 116,82 arc90 115,83 1,83 arc90
  pour Top (isolate 0.2, rank 6): 0,82 0,1 arc90 1,0 115,0 arc90 116,1 116,82 arc90 115,83 1,83 arc90
  pour Top (no thermals): 97.4,39.1 96.5,39.1 96.3,39.3 95.7,39.3 95.7,38.8 96.2,38.8 96.5,38.5 97.4,38.5
  pour Route15 (isolate 0.2, rank 6): 0,82 0,1 arc90 1,0 115,0 arc90 116,1 116,82 arc90 115,83 1,83 arc90
LVDS0+
  Top 0.2: U2.9 85.6,41.75 | U1.40 29.4,41.75
  Top 0.35: 29.4,41.75 30.02,41.75 30.6,42.32 R1.1 84.29,42.33 84.86,41.75 85.6,41.75
LVDS0-
  Top 0.2: U2.8 85.6,42.25 | U1.41 29.4,42.25
  Top 0.35: 85.6,42.25 85.18,42.25 84.51,42.92 R1.2 30.3,42.93 29.62,42.25 29.4,42.25
LVDS1+
  Top 0.2: U2.11 85.6,40.75 | U1.38 29.4,40.75
  Top 0.35: 29.4,40.75 30.72,40.75 31.05,41.08 R3.2 | R3.2 | R3.2 83.92,41.08 84.25,40.75 85.6,40.75
LVDS1-
  Top 0.2: U2.10 85.6,41.25 | U1.39 29.4,41.25
  Top 0.35: 29.4,41.25 30.32,41.25 30.75,41.68 R3.1 84.18,41.68 84.6,41.25 85.6,41.25
LVDS2+
  Top 0.2: U2.15 85.6,38.75 | U1.34 29.4,38.75
  Top 0.35: 29.4,38.75 30.15,38.75 30.56,38.34 83.72,38.34 R2.2 83.75,38.34 84.25,38.34 84.66,38.75 85.6,38.75
LVDS2-
  Top 0.152: R2.1 83.74,38.95
  Top 0.2: U2.14 85.6,39.25 | U1.35 29.4,39.25
  Top 0.35: 29.4,39.25 30.55,39.25 30.85,38.95 83.73,38.95 R2.1 | 85.6,39.25 84.35,39.25 84.05,38.95 83.74,38.95
LVDSCLK+
  Top 0.2: U2.17 85.6,37.75 | U1.32 29.34,37.75
  Top 0.35: 29.34,37.75 29.52,37.75 30.2,37.08 R4.2 84.5,37.08 85.18,37.75 85.6,37.75
LVDSCLK-
  Top 0.2: U2.16 85.6,38.25 | U1.33 29.4,38.25
  Top 0.35: 29.4,38.25 29.85,38.25 30.43,37.68 R4.1 84.31,37.68 84.88,38.25 85.6,38.25
N$9
  Top 0.2: JP1.2 31.9,53.03 31.9,45 30.65,43.75 U1.44
N$10
  Top 0.2: JP1.4 31.3,51.09 31.3,45.3 30.25,44.25 U1.45
N$11
  Top 0.2: JP1.6 30.7,49.15 30.7,45.8 30.15,45.25 U1.47
N$12
  Top 0.2: JP1.8 28.62,48.69 U1.48
N$13
  Top 0.2: JP1.10 20.09,54.69 20.09,46.21 20.55,45.75 U1.1
N$14
  Top 0.2: U1.3 14.25,44.75 12.73,46.27 12.73,59.5 JP1.12
N$15
  Top 0.2: U1.4 14.19,44.25 12.4,46.05 12.4,57.3 JP1.14
N$16
  Top 0.127: 7.02,60.18 JP1.16
  Top 0.2: U1.6 20.1,43.25 19.52,43.83 14.13,43.83 12.05,45.9 12.05,55.15 7.02,60.18
N$17
  Top 0.127: U1.7
  Top 0.2: U1.7 20.1,42.75 19.37,43.48 13.98,43.48 11.68,45.78 11.68,52.93 JP1.18
N$18
  Top 0.127: 7,55.1 JP1.20
  Top 0.2: 7,55.1 11.3,50.8 11.3,43.5 13.8,41 19.33,41 20.08,41.75 U1.9
N$19
  Top 0.2: JP1.22 10.97,48.56 10.97,43.27 13.6,40.64 19.57,40.64 20.13,41.2 21.33,41.2 U1.10
N$20
  Top 0.2: U1.12 13.47,40.25 10.64,43.08 10.64,46.35 JP1.24
N$21
  Top 0.2: JP1.26 10.32,44.13 10.32,42.89 13.46,39.75 U1.13
N$22
  Top 0.2: U1.15 19.88,38.75 19.51,38.39 19.51,37.41 19.3,37.2 14.71,37.2 JP1.28
N$23
  Top 0.2: U1.16 21.33,38.2 20.13,38.2 19.86,37.93 19.86,37.29 19.43,36.87 12.5,36.87 JP1.30
N$24
  Top 0.2: U1.18 20.29,37.25 19.54,36.5 10.33,36.5 JP1.32
N$25
  Top 0.2: U1.19 20.3,36.75 19.72,36.17 8.12,36.17 JP1.34
N$26
  Top 0.2: U1.20 20.35,36.25 19.95,35.85 8.04,35.85 JP1.36
N$27
  Top 0.2: JP1.38 19.34,32.24 20.22,33.12 20.22,34.69 20.77,35.25 U1.22
N$28
  Top 0.2: JP1.40 17.28,29.7 20.56,32.98 20.56,34.53 20.78,34.75 U1.23
N$29
  Top 0.2: JP1.42 25.16,27.16 26.9,28.9 26.9,33.43 27.72,34.25 U1.25
N$30
  Top 0.2: JP1.44 9.8,24.62 | 9.8,24.62 23.62,24.62 29.6,30.6 29.6,34.5 29.35,34.75 U1.26 | TP2.TP 9.82,24.6 9.8,24.62
N$31
  Top 0.2: U2.24 85.68,34.25 85.31,33.89 85.31,30.86 JP2.4
N$32
  Top 0.2: U2.26 94.45,34.75 94.8,34.41 94.8,23.92 JP2.6
N$33  (via drill 0.25)
  Top 0.2: R5.1 32.12,31.45 v32.1,31.46 | v26.4,34.1 26.4,34.9 26.75,35.25 U1.27
  Bottom 0.2: v32.1,31.46 29.04,31.46 v26.4,34.1
N$34  (via drill 0.25)
  Top 0.2: U2.22 87.85,35.25 v88.2,34.9 | v84.3,31.45 R6.2
  Bottom 0.2: v88.2,34.9 88.2,32.9 86.75,31.45 v84.3,31.45
N$35
  Top 0.2: U2.27 94.41,35.25 95.12,34.54 95.12,26.13 JP2.8
N$36
  Top 0.2: U2.29 98.15,36.25 99.43,34.97 99.43,24.36 JP2.10
N$37
  Top 0.2: U2.30 98.15,36.75 99.75,35.15 99.75,26.58 JP2.12
N$38
  Top 0.2: U2.31 98.11,37.25 100.08,35.28 100.08,28.79 JP2.14
N$39
  Top 0.2: U2.33 94.78,38.25 95.42,37.61 98.21,37.61 100.41,35.42 100.41,31 JP2.16
N$40
  Top 0.2: U2.34 94.74,38.75 95.55,37.94 98.34,37.94 100.73,35.55 100.73,33.22 JP2.18
N$41
  Top 0.2: U2.35 94.71,39.25 95.68,38.27 98.47,38.27 101.06,35.69 101.06,35.43 JP2.20
N$42
  Top 0.2: U2.37 94.82,40.25 95.32,40.75 100.76,40.75 101.39,40.12 101.39,37.6 101.43,37.6 JP2.22
N$43
  Top 0.2: U2.39 100.72,41.25 101.72,40.26 101.72,39.85 JP2.24
N$44
  Top 0.2: JP2.26 109.25,34.86 102.37,41.74 U2.40
N$45
  Top 0.2: JP2.28 104.4,42.25 U2.41
N$48
  Top 0.2: JP2.52 TP10.1
N$49
  Top 0.2: JP2.54 105.56,70.34 TP11.1
N$50
  Top 0.2: JP2.56 105.52,72.88 TP12.1
N$51
  Top 0.2: JP2.58 105.58,75.42 TP13.1
N$52
  Top 0.2: TP14.1 109.29,78 JP2.60
N$53
  Top 0.2: U2.43 94.75,43.25 96.3,44.8 104.39,44.8 JP2.30
N$54
  Top 0.2: U2.45 95.25,44.25 96.13,45.13 106.6,45.13 JP2.32
N$55
  Top 0.2: U2.46 95.29,44.75 95.99,45.45 108.82,45.45 JP2.34
N$56
  Top 0.2: U2.47 95.33,45.25 97.56,47.48 JP2.36
N$57
  Top 0.2: 33.19,28.3 R5.2 R6.1 38.02,30.05 TP1.1 | 33.19,28.3 33.19,26.49 21.16,14.46 JP1.52 | R7.1 34.5,28.3 33.19,28.3
N$58
  Top 0.2: TP3.1 6.99,11.9 JP1.54
N$59
  Top 0.2: TP4.1 6.99,9.4 JP1.56
N$60
  Top 0.2: TP5.1 7.01,6.8 JP1.58
N$61
  Top 0.2: TP6.1 JP1.60
N$62
  Top 0.2: U2.1 85.55,45.75 85.2,46.1 85.2,48.3 86.92,50.02 JP2.38
N$63
  Top 0.2: U2.2 85.55,45.25 84.8,46 84.8,49 88.36,52.56 JP2.40
N$64
  Top 0.2: U2.4 84.98,44.25 84.47,44.77 84.47,50.13 89.44,55.1 JP2.42
N$65
  Top 0.2: U2.5 85.02,43.75 84.15,44.63 84.15,52.87 88.92,57.64 JP2.44
N$66
  Top 0.2: U2.23 85.68,34.75 84.91,33.99 84.91,28.72 87.47,26.16 87.5,26.13 | JP2.2 87.5,26.13 | TP7.TP 87.5,26.13
NUCLEOSUPPLY
  Route15 1: JP1.48 JP1.47 JP1.49 | JP1.48 JP1.50 | JP3.3 57.26,58.6 19.7,58.6 11.77,50.67 11.77,24.34 JP1.48
  pour Route15 (isolate 0.2, no thermals): 3.3,20.8 3.3,15.8 8.1,15.8 8.1,20.8

### Text on the board
tPlace: Tx0 | Rx20 | LVDS Tx | LVDS Rx | Tx20 | TxCLKIn | Rx0 | OreSat Channel Link Test Board V1.0 / David Lay (dalay@pdx.edu) 7/16/20 | RxCLKOut
tNames: VccTX | VccRx